# Altium schematic sheet AFBR-RX-fiber_optic_reciever.SchDoc
size A4; SheetNumber: 2; SheetTotal: 3
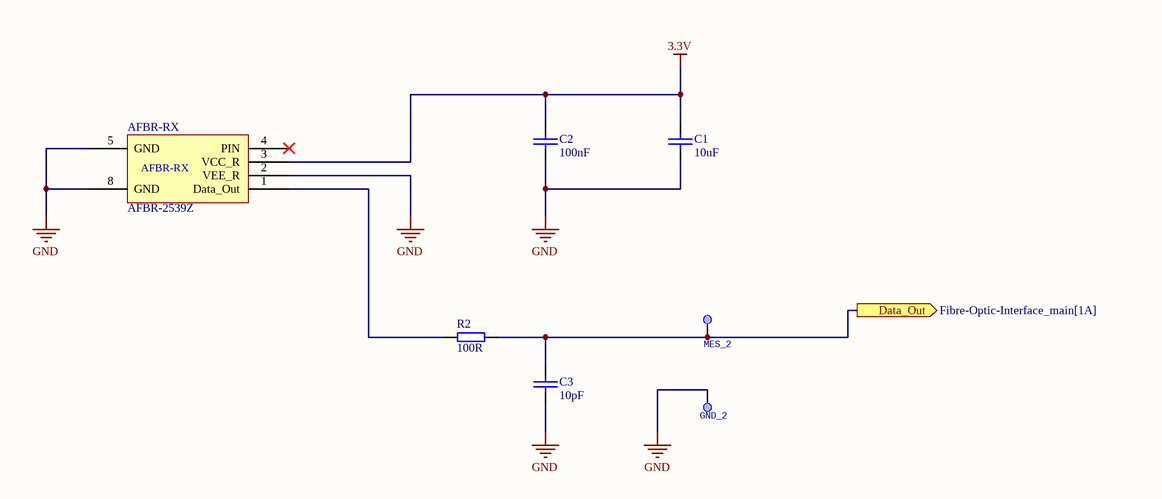
[diagram p0: AFBR-RX-fiber_optic_reciever.SchDoc]

## Parts
AFBR-RX  AFBR-2539Z  [AFBR-TX/RX-HORIZONTAL]
C1  10uF  [1206]
C2  100nF  [0603C]
C3  10pF  [0603C]
GND_2  PK_1  [PK]  (value not drawn)  (no BOM)
MES_2  PK_1  [PK]  (value not drawn)  (no BOM)
R2  100R  [0603R]

## Ports
Data_Out (out, see Fibre-Optic-Interface_main[1A])

## Nets
3.3V: AFBR-RX.3(VCC_R) C1.1 C2.1
GND: AFBR-RX.2(VEE_R) AFBR-RX.5(GND) AFBR-RX.8(GND) C1.2 C2.2 C3.2 GND_2.1
Data_Out: C3.1 MES_2.1 R2.2 ; port Data_Out
NetAFBR-RX_1: AFBR-RX.1(Data_Out) R2.1

Not connected (* = marked no-connect by the designer): AFBR-RX 4(PIN)*

## Library data of the parts
AFBR-RX = AFBR-RX: Fiber Optic Transmitters, Receivers, Transceivers VL V 50MBd RX inv
C1 = C_1: Capacitor
C2 = C: Capacitor
C3 = C_3: Capacitor
GND_2 MES_2 = PK_1: Punkt; ClassName: Mechanical
R2 = R_1